# Altium schematic sheet USB and Power.SchDoc
size A; SheetNumber: 1; SheetTotal: 5
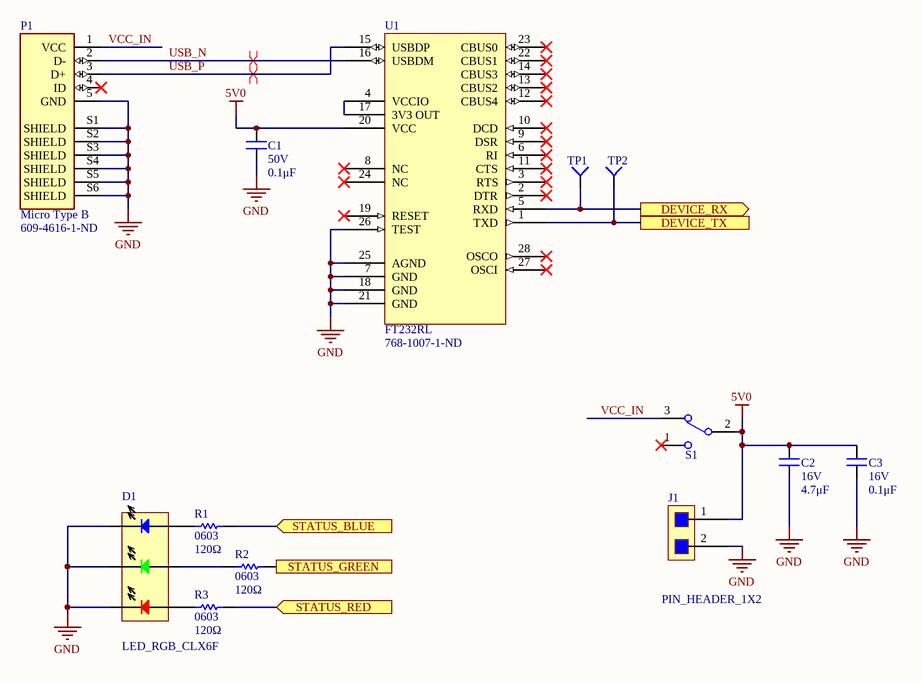
[diagram p0: USB and Power.SchDoc]

## Parts
C1  value 0.1μF  Voltage Rating: 50V  [CAP0603]  (hidden comment: CAP_0.1uF_50V_0603)
C2  value 4.7μF  Voltage Rating: 16V  [CAP0603]  (hidden comment: CAP_4.7uF_16V_0603)
C3  value 0.1μF  Voltage Rating: 16V  [CAP0603]  (hidden comment: CAP_0.1uF_16V_0603)
D1  LED_RGB_CLX6F  [SOJ100P350X290-6N]
J1  PIN_HEADER_1X2  [PIN_HEADER - 1X2]
P1  Micro Type B  Supplier Part Number 1: 609-4616-1-ND  [FCI_10118193-0001LF]
R1  value 120Ω  Package/Footprint: 0603  [RES0603]  (hidden comment: RES_120Ω_0603)
R2  value 120Ω  Package/Footprint: 0603  [RES0603]  (hidden comment: RES_120Ω_0603)
R3  value 120Ω  Package/Footprint: 0603  [RES0603]  (hidden comment: RES_120Ω_0603)
S1  SW_TOGGLE_SPDT  [100SP1T1B4M2QE]  (value not drawn)
TP1  TESTPT  [TESTPT SQUARE]  (value not drawn)
TP2  TESTPT  [TESTPT SQUARE]  (value not drawn)
U1  FT232RL  Supplier Part Number 1: 768-1007-1-ND  [FT232RL]

## Ports
DEVICE_RX (out), DEVICE_TX, STATUS_BLUE (in), STATUS_GREEN (in), STATUS_RED (in)

## Nets
5V0: C1.2 C2.2 C3.2 J1.1 S1.2 U1.20(VCC)
GND: C1.1 C2.1 C3.1 D1.1(BLUE_-) D1.2(GREEN_-) D1.3(RED_-) J1.2 P1.5(GND) P1.S1(SHIELD) P1.S2(SHIELD) P1.S3(SHIELD) P1.S4(SHIELD) P1.S5(SHIELD) P1.S6(SHIELD) U1.7(GND) U1.18(GND) U1.21(GND) U1.25(AGND) U1.26(TEST)
DEVICE_RX: TP1.1(=value) U1.5(RXD) ; port DEVICE_RX
DEVICE_TX: TP2.1(=value) U1.1(TXD) ; port DEVICE_TX
STATUS_BLUE: R1.2 ; port STATUS_BLUE
STATUS_GREEN: R2.2 ; port STATUS_GREEN
STATUS_RED: R3.2 ; port STATUS_RED
USB_N: P1.2(D-) U1.16(USBDM)
USB_P: P1.3(D+) U1.15(USBDP)
VCC_IN: P1.1(VCC) S1.3
NetD1_4: D1.4(Red_+) R3.1
NetD1_5: D1.5(Green_+) R2.1
NetD1_6: D1.6(Blue_+) R1.1
NetU1_4: U1.4(VCCIO) U1.17(3V3_OUT)

Not connected (* = marked no-connect by the designer): P1 4(ID)*; S1 1*; U1 2(DTR)* 3(RTS)* 6(RI)* 8(NC)* 9(DSR)* 10(DCD)* 11(CTS)* 12(CBUS4)* 13(CBUS2)* 14(CBUS3)* 19(RESET)* 22(CBUS1)* 23(CBUS0)* 24(NC)* 27(OSCI)* 28(OSCO)*

## Layout directives
differential pair: USB_N, USB_P

## Library data of the parts
C1 = CAP_0.1uF_50V_0603: CAP CER 0.1UF 50V X7R 0603; Manufacturer Part Number 1: CC0603KRX7R9BB104; Manufacturer 1: Yageo; Package/Footprint: 0603; Supplier Part Number 1: 311-1344-1-ND; Supplier 1: Digi-Key; Mounting Type: SMD; Dielectric: X7R
C2 = CAP_4.7uF_16V_0603: CAP CER 4.7UF 16V X6S 0603; Manufacturer Part Number 1: GRM188C81C475KE11D; Manufacturer 1: Murata Electronics; Package/Footprint: 0603; Supplier Part Number 1: 490-13362-1-ND; Supplier 1: Digi-Key; Mounting Type: SMD; Dielectric: X6S
C3 = CAP_0.1uF_16V_0603: CAP CER 0.1UF 16V X7R 0603; Manufacturer Part Number 1: CC0603KRX7R7BB104; Manufacturer 1: Yageo; Package/Footprint: 0603; Supplier Part Number 1: 311-1088-1-ND; Supplier 1: Digi-Key; Dielectric: X7R
D1 = LED_RGB_CLX6F: Visible LED; Manufacturer: Cree; MP: CLX6F-FKC-CKNNQDGBB7A363; MF: Cree Inc.; Optoelectronic Device Type: TRIPLE COLOR LED; Value: *; SnapEDA_Link: https://www.snapeda.com/parts/CLX6F-FKC-CKNNQDGBB7A363/Cree%20Inc./view-part/641291/?ref=snap; Package: PLCC-6 Cree; Digi-Key_Part_Number: CLX6F-FKC-CKNNQDGBB7A363CT-ND; Digi-Key_Purchase_URL: https://www.digikey.de/product-detail/en/cree-inc/CLX6F-FKC-CKNNQDGBB7A363/CLX6F-FKC-CKNNQDGBB7A363CT-ND/9452642?utm_source=snapeda&utm_medium=aggregator&utm_campaign=symbol; Supplier 1: Digi-Key; Manufacturer Part Number: CLX6F-FKC-CKNNQDGBB7A363; RoHS: Yes; Category: LEDs; Stock 1: 37409; Pricing 1: 1=0.30000, 10=0.27900, 100=0.25800, 1000=0.23077 (USD); REACH SVHC: No SVHC; RoHS Compliant: Yes; ComponentLink1URL: https://datasheet.ciiva.com:443/pdfs/VipMasterIC/IC/CREE/CREE-S-A0009778122/CREE-S-A0009831345-1.pdf?src-supplier=IHS+Markit; ComponentLink1Description: https://datasheet.ciiva.com:443/pdfs/VipMasterIC/IC/CREE/CREE-S-A0009778122/CREE-S-A0009831345-1.pdf?src-supplier=IHS+Markit; ComponentLink2URL: http://www.farnell.com/datasheets/2813756.pdf?src-supplier=Farnell; ComponentLink2Description: http://www.farnell.com/datasheets/2813756.pdf?src-supplier=Farnell; ComponentLink3URL: http://www.mouser.com/ds/2/90/CLX6F-FKC-1352-1064258.pdf?src-supplier=Mouser; ComponentLink3Description: http://www.mouser.com/ds/2/90/CLX6F-FKC-1352-1064258.pdf?src-supplier=Mouser; ComponentLink4URL: http://www.farnell.com/datasheets/2813756.pdf?src-supplier=Element14; ComponentLink4Description: http://www.farnell.com/datasheets/2813756.pdf?src-supplier=Element14; ComponentLink5URL: http://www.farnell.com/datasheets/2813756.pdf?src-supplier=Newark; ComponentLink5Description: http://www.farnell.com/datasheets/2813756.pdf?src-supplier=Newark; ComponentLink6URL: https://www.cree.com/led-components/media/documents/CLX6F-FKC-1352.pdf?src-supplier=Digi-Key; ComponentLink6Description: https://www.cree.com/led-components/media/documents/CLX6F-FKC-1352.pdf?src-supplier=Digi-Key; Supplier Part Number 1: CLX6F-FKC-CKNNQDGBB7A363CT-ND
J1 = PIN_HEADER_1X2: Board Connector, 1 Contact(s), 1 Row(s), Male, Straight, Solder Terminal; Manufacturer: Sullins; Manufacturer Part Number: PREC001SAAN-RC; Option: General Purpose; Filter Feature: No; Number of Rows Loaded: 1; Supplier 1: Digi-Key; RoHS: Yes; Category: Connectors; Stock 1: 16681; Pricing 1: 1=0.04000, 10=0.03000, 25=0.02800, 50=0.02080, 100=0.01780, 250=0.01724, 500=0.01486 (USD); Mount: Board; Connector Type: BOARD CONNECTOR; Contact Gender: Male; Mixed Contacts: No; Mounting Style: STRAIGHT; Termination: Solder; Number of Contacts: 1; Flammability Rating: UL94 V-0; DIN Conformance: No; IEC Conformance: No; MIL Conformance: No; ComponentLink1URL: https://datasheet.ciiva.com:443/pdfs/VipMasterIC/IC/SUCS/SUCS-S-A0005121173/SUCS-S-A0005121173-1.pdf?src-supplier=IHS+Markit; ComponentLink1Description: https://datasheet.ciiva.com:443/pdfs/VipMasterIC/IC/SUCS/SUCS-S-A0005121173/SUCS-S-A0005121173-1.pdf?src-supplier=IHS+Markit; ComponentLink2URL: https://datasheet.ciiva.com/740/zrzczzzszzn-rc-st-11635-b-740844.pdf?src-supplier=Digi-Key; ComponentLink2Description: https://datasheet.ciiva.com/740/zrzczzzszzn-rc-st-11635-b-740844.pdf?src-supplier=Digi-Key; Supplier Part Number 1: S1012EC-01-ND
P1 = USB Connector: USB Connector, 5 Contact(s), Female, Right Angle, Solder Terminal, Locking, Receptacle; Manufacturer: Amphenol FCI; Manufacturer Part Number: 10118193-0001LF; Manufacturer Series: 10118193; Contact Resistance: 30mR; Durability: 10000Cycles; Empty Shell: No; Insertion Force-Max: 35.1392N; Insulation Resistance: 1GR; Mating Information: MULTIPLE MATING PARTS AVAILABLE; Number Of Connectors: 1; PCB Contact Pattern: RECTANGULAR; Polarization Key: POLAR PIN POSITION; Rated Current (Signal): 1.8A; Number of Contacts: 5; Connector Type: TELECOM AND DATACOM CONNECTOR; Option: General Purpose; Board Mounting Option: LOCATING POSTS; Plating Thickness: 30uin; Body Breadth: 0.122inch; Body Depth: 0.199inch; Body Length: 0.309inch; Reference Standard: UL; Reliability: COMMERCIAL; Supplier 1: Digi-Key; RoHS: Yes; Category: USB Connectors; Stock 1: 43659; Pricing 1: 1=0.45000, 10=0.43000, 25=0.36840, 50=0.31320, 100=0.30090, 250=0.27016, 500=0.25788 (USD); ComponentLink1URL: https://datasheet.ciiva.com:443/pdfs/VipMasterIC/IC/FRCI/FRCI-S-A0000088532/FRCI-S-A0001133856-1.pdf?src-supplier=IHS+Markit; ComponentLink1Description: https://datasheet.ciiva.com:443/pdfs/VipMasterIC/IC/FRCI/FRCI-S-A0000088532/FRCI-S-A0001133856-1.pdf?src-supplier=IHS+Markit; Mount: Board; Insulation Material: Polymer; Shell Finish: Tin; Shell Material: Stainless Steel; Contact Material: Copper Alloy; Contact Finish - Mating: GOLD (30) OVER NICKEL; Contact Finish - Termination: GOLD FLASH OVER NICKEL; Contact Gender: Female; Contact Style: USB; Filter Feature: No; Mixed Contacts: No; Mounting Style: RIGHT ANGLE; Number Of PCB Rows: 1; Termination: Solder; JESD-609 Code: e4; Body/Shell Style: RECEPTACLE; Mounting Option 1: LOCKING; Terminal Pitch: 0.6604mm; Flammability Rating: UL94 V-0; DIN Conformance: No; IEC Conformance: No; MIL Conformance: No; ComponentLink2URL: https://datasheet.ciiva.com/851/10118193-851106.pdf?src-supplier=Digi-Key; ComponentLink2Description: https://datasheet.ciiva.com/851/10118193-851106.pdf?src-supplier=Digi-Key; ComponentLink3URL: https://datasheet.ciiva.com/26853/getdatasheetpartid-418618-26853893.pdf?src-supplier=Verical; ComponentLink3Description: https://datasheet.ciiva.com/26853/getdatasheetpartid-418618-26853893.pdf?src-supplier=Verical; ComponentLink4URL: https://datasheet.ciiva.com/4598/10118193ac-197151-4598799.pdf?src-supplier=Mouser; ComponentLink4Description: https://datasheet.ciiva.com/4598/10118193ac-197151-4598799.pdf?src-supplier=Mouser; ComponentLink5URL: https://datasheet.ciiva.com/14802/10118193-0001lf-webpage-14802386.pdf?src-supplier=Arrow+Electronics; ComponentLink5Description: https://datasheet.ciiva.com/14802/10118193-0001lf-webpage-14802386.pdf?src-supplier=Arrow+Electronics; ComponentLink6URL: https://datasheet.ciiva.com/851/10118193-851107.pdf?src-supplier=Digi-Key; ComponentLink6Description: https://datasheet.ciiva.com/851/10118193-851107.pdf?src-supplier=Digi-Key; ComponentLink7URL: https://datasheet.ciiva.com/851/10118193-851108.pdf?src-supplier=Digi-Key; ComponentLink7Description: https://datasheet.ciiva.com/851/10118193-851108.pdf?src-supplier=Digi-Key; ComponentLink8URL: https://datasheet.ciiva.com/14618/70236827-14618887.pdf?src-supplier=Allied+Electronics; ComponentLink8Description: https://datasheet.ciiva.com/14618/70236827-14618887.pdf?src-supplier=Allied+Electronics
R1-R3 = RES_120Ω_0603_5%: RES 120 OHM 5% 1/10W 0603; Manufacturer 1: Yageo; Manufacturer Part Number 1: RC0603JR-07120RL; Supplier Part Number 1: 311-120GRCT-ND; Supplier 1: Digi-Key; Mounting Type: SMD
S1 = SW_TOGGLE_SPDT: SWITCH TOGGLE SPDT 5A 120V; Manufacturer 1: E-Switch; Voltage Rating (DC): 28V; Package/Footprint: TH; Supplier 1: Digi-Key; Mounting Type: TH; Throw Configuration: SPDT; Supplier Part Number 1: EG2355-ND; Manufacturer Part Number 1: 100SP1T1B4M2QE
TP1 TP2 = TESTPT SQUARE
U1 = FT232RL: USB Bus Controller, CMOS, PDSO28; Manufacturer: FTDI; Manufacturer Part Number: FT232RL-REEL; Package Body Material: Plastic; Max Frequency: 48MHz; Max Supply Current: 100uA; Max Supply Voltage: 5.25V; Min Supply Voltage: 3.3V; Qualification Status: Not Qualified; Supplier 1: Digi-Key; RoHS: Yes; Category: Interface ICs; Stock 1: 118964; Pricing 1: 1=4.50000, 10=4.05000, 50=3.85000, 100=3.65000, 250=3.25000, 500=2.85002, 1000=2.65000 (USD); Package Code: SSOP; Number of Pins: 28; Package Shape: Rectangular; Min Operating Temperature: -40°C; Max Operating Temperature: 85°C; JESD-30 Code: R-PDSO-G28; Moisture Sensitivity Level: 3; Package Style: SMALL OUTLINE, SHRINK PITCHMeter; Surface Mount: Yes; Technology: CMOS; Terminal Form: Gull Wing; Terminal Position: DUAL; Length: 10.2mm; Width: 5.3mm; Height - Seated (Max): 2mm; Terminal Pitch: 0.65mm; Temperature Grade: INDUSTRIAL; ComponentLink1URL: https://datasheet.ciiva.com:443/pdfs/VipMasterIC/IC/FTDI/FTDI-S-A0007980421/FTDI-S-A0007980421-1.pdf?src-supplier=IHS+Markit; ComponentLink1Description: https://datasheet.ciiva.com:443/pdfs/VipMasterIC/IC/FTDI/FTDI-S-A0007980421/FTDI-S-A0007980421-1.pdf?src-supplier=IHS+Markit; ComponentLink2URL: https://datasheet.ciiva.com/34304/2161019-34304054.pdf?src-supplier=Jameco; ComponentLink2Description: https://datasheet.ciiva.com/34304/2161019-34304054.pdf?src-supplier=Jameco; ComponentLink3URL: https://datasheet.ciiva.com/4787/ds-ft232r-11534-4787658.pdf?src-supplier=Mouser; ComponentLink3Description: https://datasheet.ciiva.com/4787/ds-ft232r-11534-4787658.pdf?src-supplier=Mouser; ComponentLink4URL: https://datasheet.ciiva.com/26841/ft232rl-reel-26841080.pdf?src-supplier=IIIC; ComponentLink4Description: https://datasheet.ciiva.com/26841/ft232rl-reel-26841080.pdf?src-supplier=IIIC; ComponentLink5URL: https://datasheet.ciiva.com/1787/ds-ft232r-1787047.pdf?src-supplier=Digi-Key; ComponentLink5Description: https://datasheet.ciiva.com/1787/ds-ft232r-1787047.pdf?src-supplier=Digi-Key; ComponentLink6URL: https://datasheet.ciiva.com/1787/ds-ft232r-1787048.pdf?src-supplier=Digi-Key; ComponentLink6Description: https://datasheet.ciiva.com/1787/ds-ft232r-1787048.pdf?src-supplier=Digi-Key; ComponentLink7URL: https://datasheet.ciiva.com/1787/ds-ft232r-1787049.pdf?src-supplier=Digi-Key; ComponentLink7Description: https://datasheet.ciiva.com/1787/ds-ft232r-1787049.pdf?src-supplier=Digi-Key; ComponentLink8URL: https://datasheet.ciiva.com/15150/getdatasheetpartid-643207-15150506.pdf?src-supplier=Verical; ComponentLink8Description: https://datasheet.ciiva.com/15150/getdatasheetpartid-643207-15150506.pdf?src-supplier=Verical; ComponentLink9URL: https://datasheet.ciiva.com/16200/ds-ft232r-16200652.pdf?src-supplier=Future+Electronics; ComponentLink9Description: https://datasheet.ciiva.com/16200/ds-ft232r-16200652.pdf?src-supplier=Future+Electronics